# Altium schematic sheet analog outputs.schdoc
size A3; Organization: Altium Limited; Address1: L3, 12a Rodborough Rd; Address2: Frenchs Forest; Address3: NSW; Address4: Australia 2086
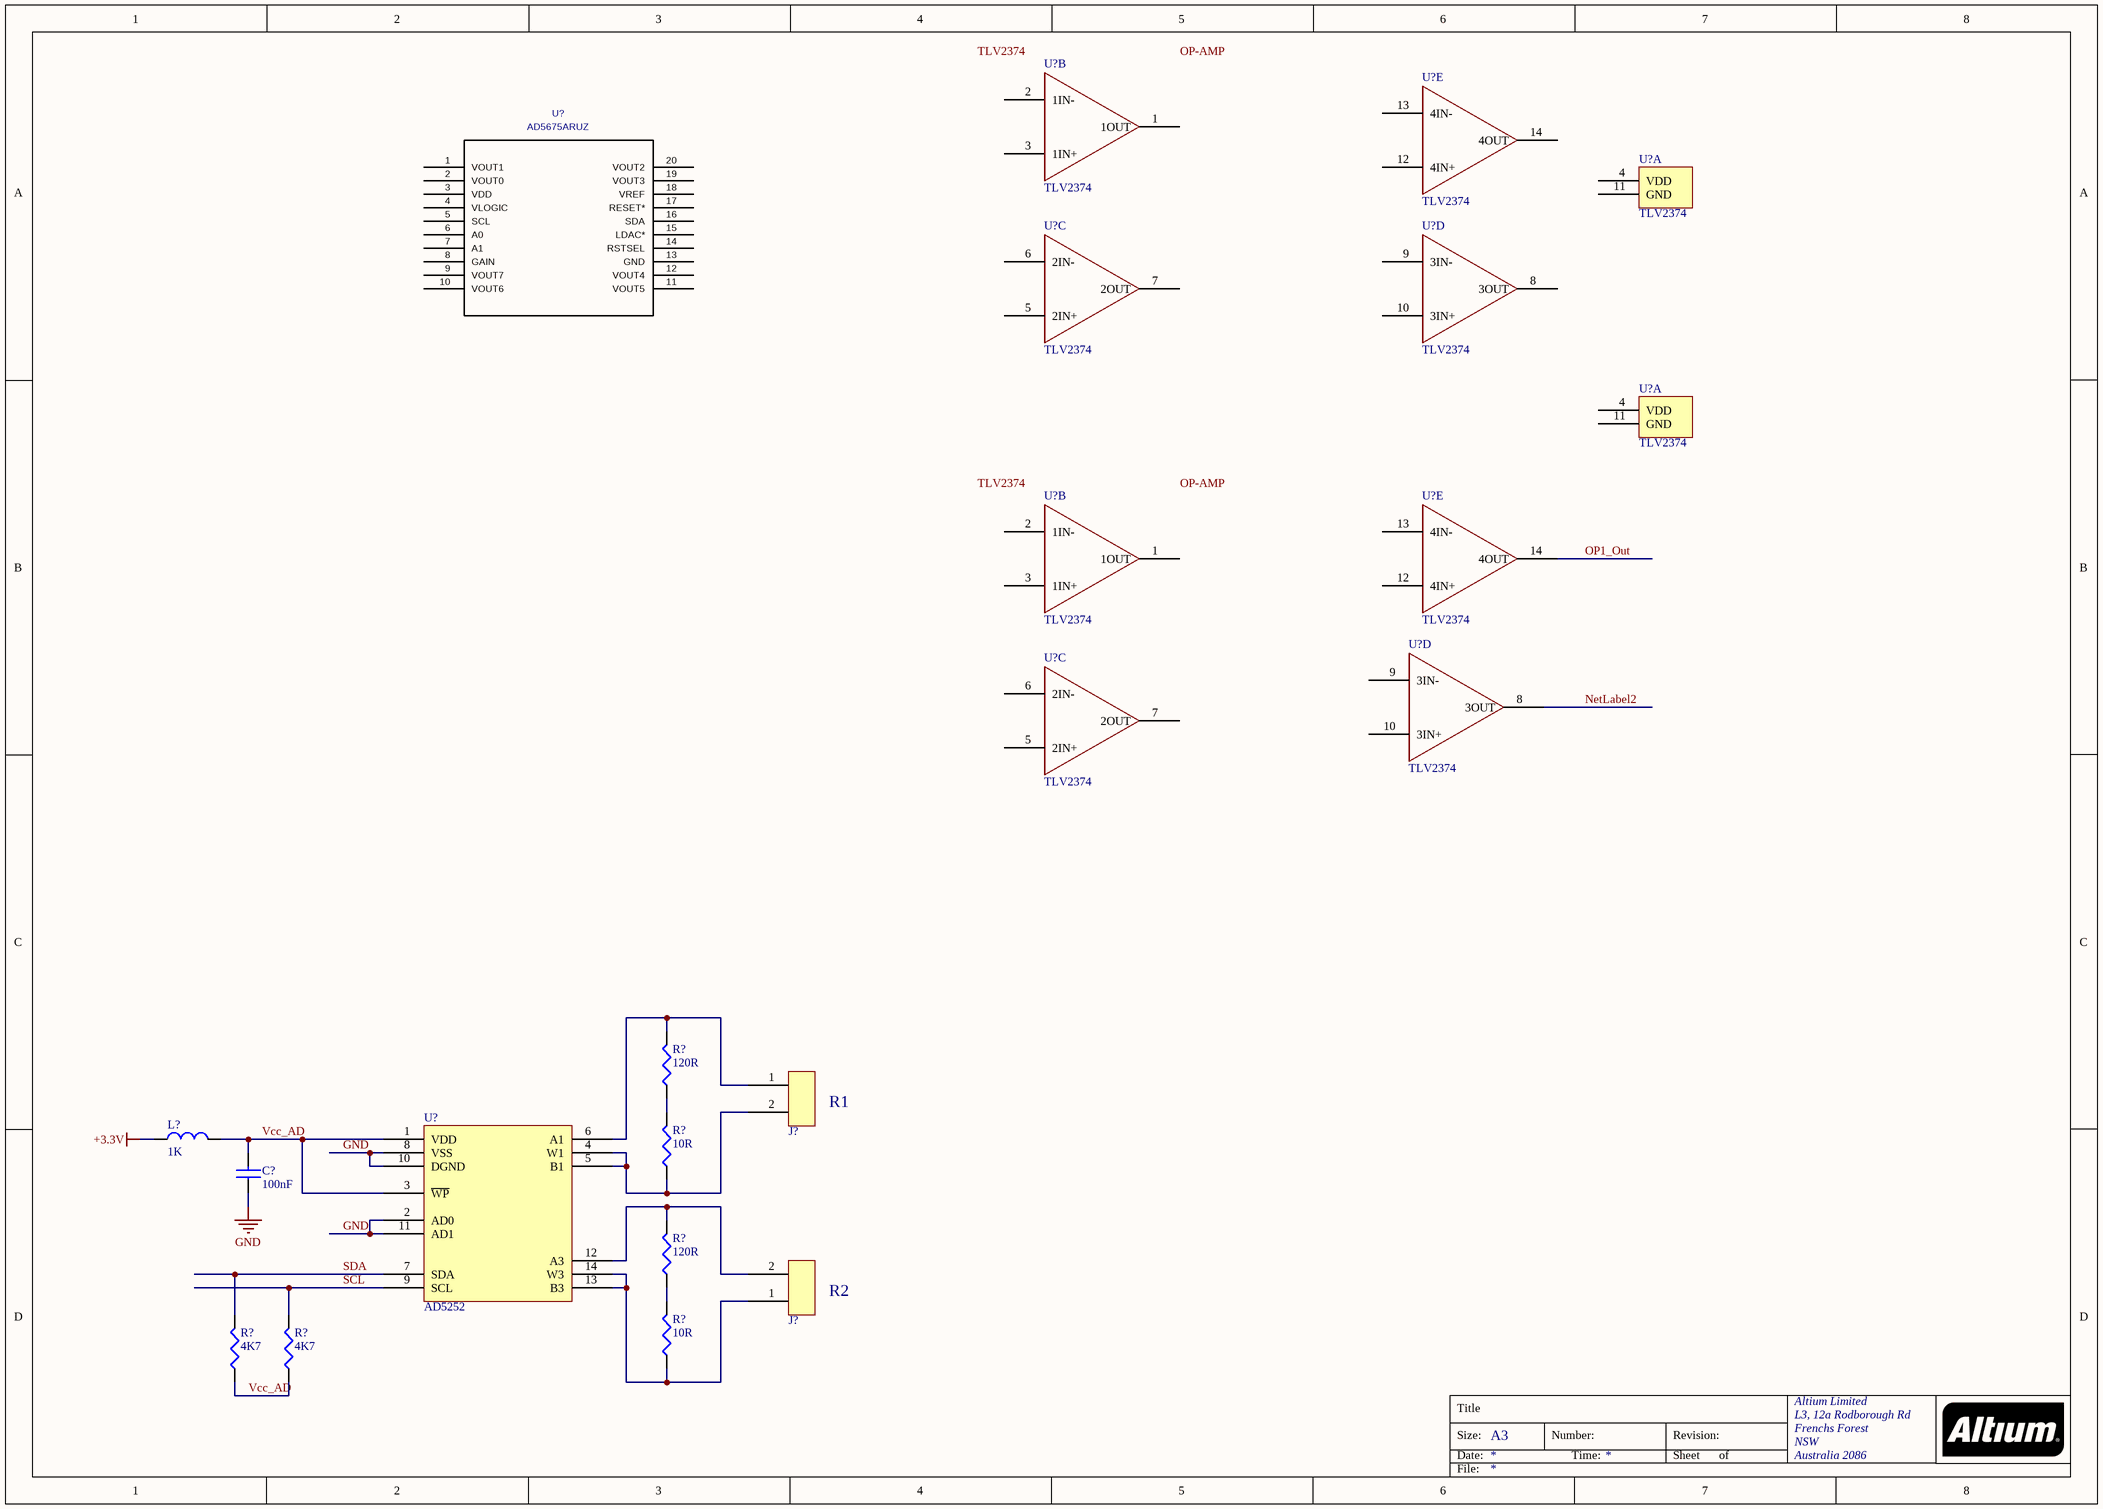
[diagram p0: analog outputs.schdoc]

## Parts
(Parts that share a designator on the sheet are numbered #1, #2 ... from top to bottom, then left to right.)
C?  value 100nF  [0805 SMD Ceramic Capacitor]  (hidden comment: C0805C104)
J?#1  2x Terminal  [2x Terminal mini]  (value not drawn)
J?#2  2x Terminal  [2x Terminal mini]  (value not drawn)
L?  value 1K  [0805 Inductor]  (hidden comment: 0805Ferrite)
R?#1  value 120R  [0805 Resistor]  (hidden comment: 0805_120R)
R?#2  value 10R  [0805 Resistor]  (hidden comment: 0805_10R)
R?#3  value 120R  [0805 Resistor]  (hidden comment: 0805_120R)
R?#4  value 10R  [0805 Resistor]  (hidden comment: 0805_10R)
R?#5  value 4K7  [0805 Resistor]  (hidden comment: 0805_4K7%1)
R?#6  value 4K7  [0805 Resistor]  (hidden comment: 0805_4K7%1)
U?#1  TLV2374  [SO14]  (part B of 5)
U?#2  TLV2374  [SO14]  (part E of 5)
U?#3  AD5675ARUZ  [TSSOP20]
U?#4  TLV2374  [SO14]  (part A of 5)
U?#5  TLV2374  [SO14]  (part C of 5)
U?#6  TLV2374  [SO14]  (part D of 5)
U?#7  TLV2374  [SO14]  (part A of 5)
U?#8  TLV2374  [SO14]  (part B of 5)
U?#9  TLV2374  [SO14]  (part E of 5)
U?#10  TLV2374  [SO14]  (part D of 5)
U?#11  TLV2374  [SO14]  (part C of 5)
U?#12  value AD5252  [TSSOP14]  (hidden comment: U)

## Nets
+3.3V: L?.1
GND: C?.1 U?#12.2(AD0) U?#12.8(VSS) U?#12.10(DGND) U?#12.11(AD1)
NetLabel2: U?#10.8(3OUT)
OP1_Out: U?#9.14(4OUT)
SCL: R?#6.2 U?#12.9(SCL)
SDA: R?#5.2 U?#12.7(SDA)
Vcc_AD: C?.2 L?.2 R?#5.1 R?#6.1 U?#12.1(VDD) U?#12.3(~{WP})
NetJ?#1_1: J?#1.1 R?#1.2 U?#12.6(A1)
NetJ?#1_2: J?#1.2 R?#2.1 U?#12.4(W1) U?#12.5(B1)
NetJ?#2_1: J?#2.1 R?#4.1 U?#12.13(B3) U?#12.14(W3)
NetJ?#2_2: J?#2.2 R?#3.2 U?#12.12(A3)
NetR?#1_1: R?#1.1 R?#2.2
NetR?#3_1: R?#3.1 R?#4.2

Not connected (* = marked no-connect by the designer): U?#1 1(1OUT) 2(1IN-) 3(1IN+); U?#2 12(4IN+) 13(4IN-) 14(4OUT); U?#3 1(VOUT1) 2(VOUT0) 3(VDD) 4(VLOGIC) 5(SCL) 6(A0) 7(A1) 8(GAIN) 9(VOUT7) 10(VOUT6) 11(VOUT5) 12(VOUT4) 13(GND) 14(RSTSEL) 15(LDAC*) 16(SDA) 17(RESET*) 18(VREF) 19(VOUT3) 20(VOUT2); U?#4 4(VDD) 11(GND); U?#5 5(2IN+) 6(2IN-) 7(2OUT); U?#6 8(3OUT) 9(3IN-) 10(3IN+); U?#7 4(VDD) 11(GND); U?#8 1(1OUT) 2(1IN-) 3(1IN+); U?#9 12(4IN+) 13(4IN-); U?#10 9(3IN-) 10(3IN+); U?#11 5(2IN+) 6(2IN-) 7(2OUT)

## Notes on the sheet
- (near J?#1) R1
- (near J?#2) R2
- Labels drawn without touching a wire or pin: OP-AMP, TLV2374
- Title
- Size:
- Date:
- A3
- Number:
- Time:
- Revision:
- Sheet
- of
- File:

## Library data of the parts
C? = C0805C104: Manufacturer Code: C0805C104J5RACTU; Manufacturer: KEMET; Voltage: 50V; Farnell Code: 1414663; Unit Price: 0,06 €; Package: 0805
J?#1 J?#2 = 2x Terminal: Manufacturer: WEIDMULLER; Manufacturer Code: PM5.08/2/90 BLK; Value: 2x Terminal; Farnell Code: 1131855; Unit Price: 0,55 €
L? = 0805Ferrite: Manufacturer Code: MMZ2012R102A; Manufacturer: TDK; Current: 500mA; Farnell Code: 1669719; Unit Price: 0,059 €
R?#1 R?#3 = 0805_120R: Manufacturer Code: MC 0.1W 0805 1% 120R; Manufacturer: MULTICOMP; Tolerance: ±1%; Farnell Code: 9332480; Unit Price: 0,03 €
R?#2 R?#4 = 0805_10R: Manufacturer Code: CRCW080510R0FKEA; Manufacturer: VISHAY DRALORIC; Tolerance: ±1%; Farnell Code: 1469859; Unit Price: 0,017 €
R?#5 R?#6 = 0805_4K7%1: Manufacturer Code: PCF0805P-R-4K7-BT1; Manufacturer: WELWYN; Tolerance: ±0.1%; Temperature Coefficient: ±25ppm/°C; Power Rating: 100mW; Unit Price: 0,34; Farnell Code: 1506096; MOQ: 5
U?#1 U?#2 U?#4-U?#11 = TLV2374: Manufacturer Code: TLV2374ID; Manufacturer: Texas Instruments; Farnell Code: 8455040; Unit Price: 1,07 €; Value: TLV2374
U?#3 = AD5675ARUZ: Vendor: Analog Devices Inc; Built_By: Analog Devices Inc.; Value: AD5675ARUZ; Manufacturer_Part_Number: AD5675ARUZ
U?#12 = AD5252: Manufacturer Code: AD5252BRUZ1; Manufacturer: Analog Devices Inc.; Unit Price: 4,26$